# Altium schematic sheet uC_HMI.SchDoc
size A3; Author: TNI; Organization: ETML-ES; Address1: Avenue Recordon 1; Address2: 1004 Lausanne; Address3: Switzerland; Revision: 1; SheetNumber: 1; SheetTotal: 3; SPICEModelCacheNXRZMLBE: <root> / <DocumentId>NXRZMLBE</DocumentId> / <CacheFrame Number="0"> / <Model Name="nmos" Kind="MDL"> / <Text>*Default N-Channel MOSFET / *Pinout: D,G,S / .MODEL NMOS NMOS()</Text> / </Model> / <Model Name="pnp" Kind="MDL"> / <Text>*Default PNP BJT / *PNP Trans Pinout: C,B,E / .MODEL PNP PNP()</Text> / </Model> / <Model Name="diode" Kind="MDL"> / <Text>*Default Diode / *Diode Pinout: A,K / .MODEL DIODE D()</Text> / </Model> / </CacheFrame> / </root>; Version: 2226_A
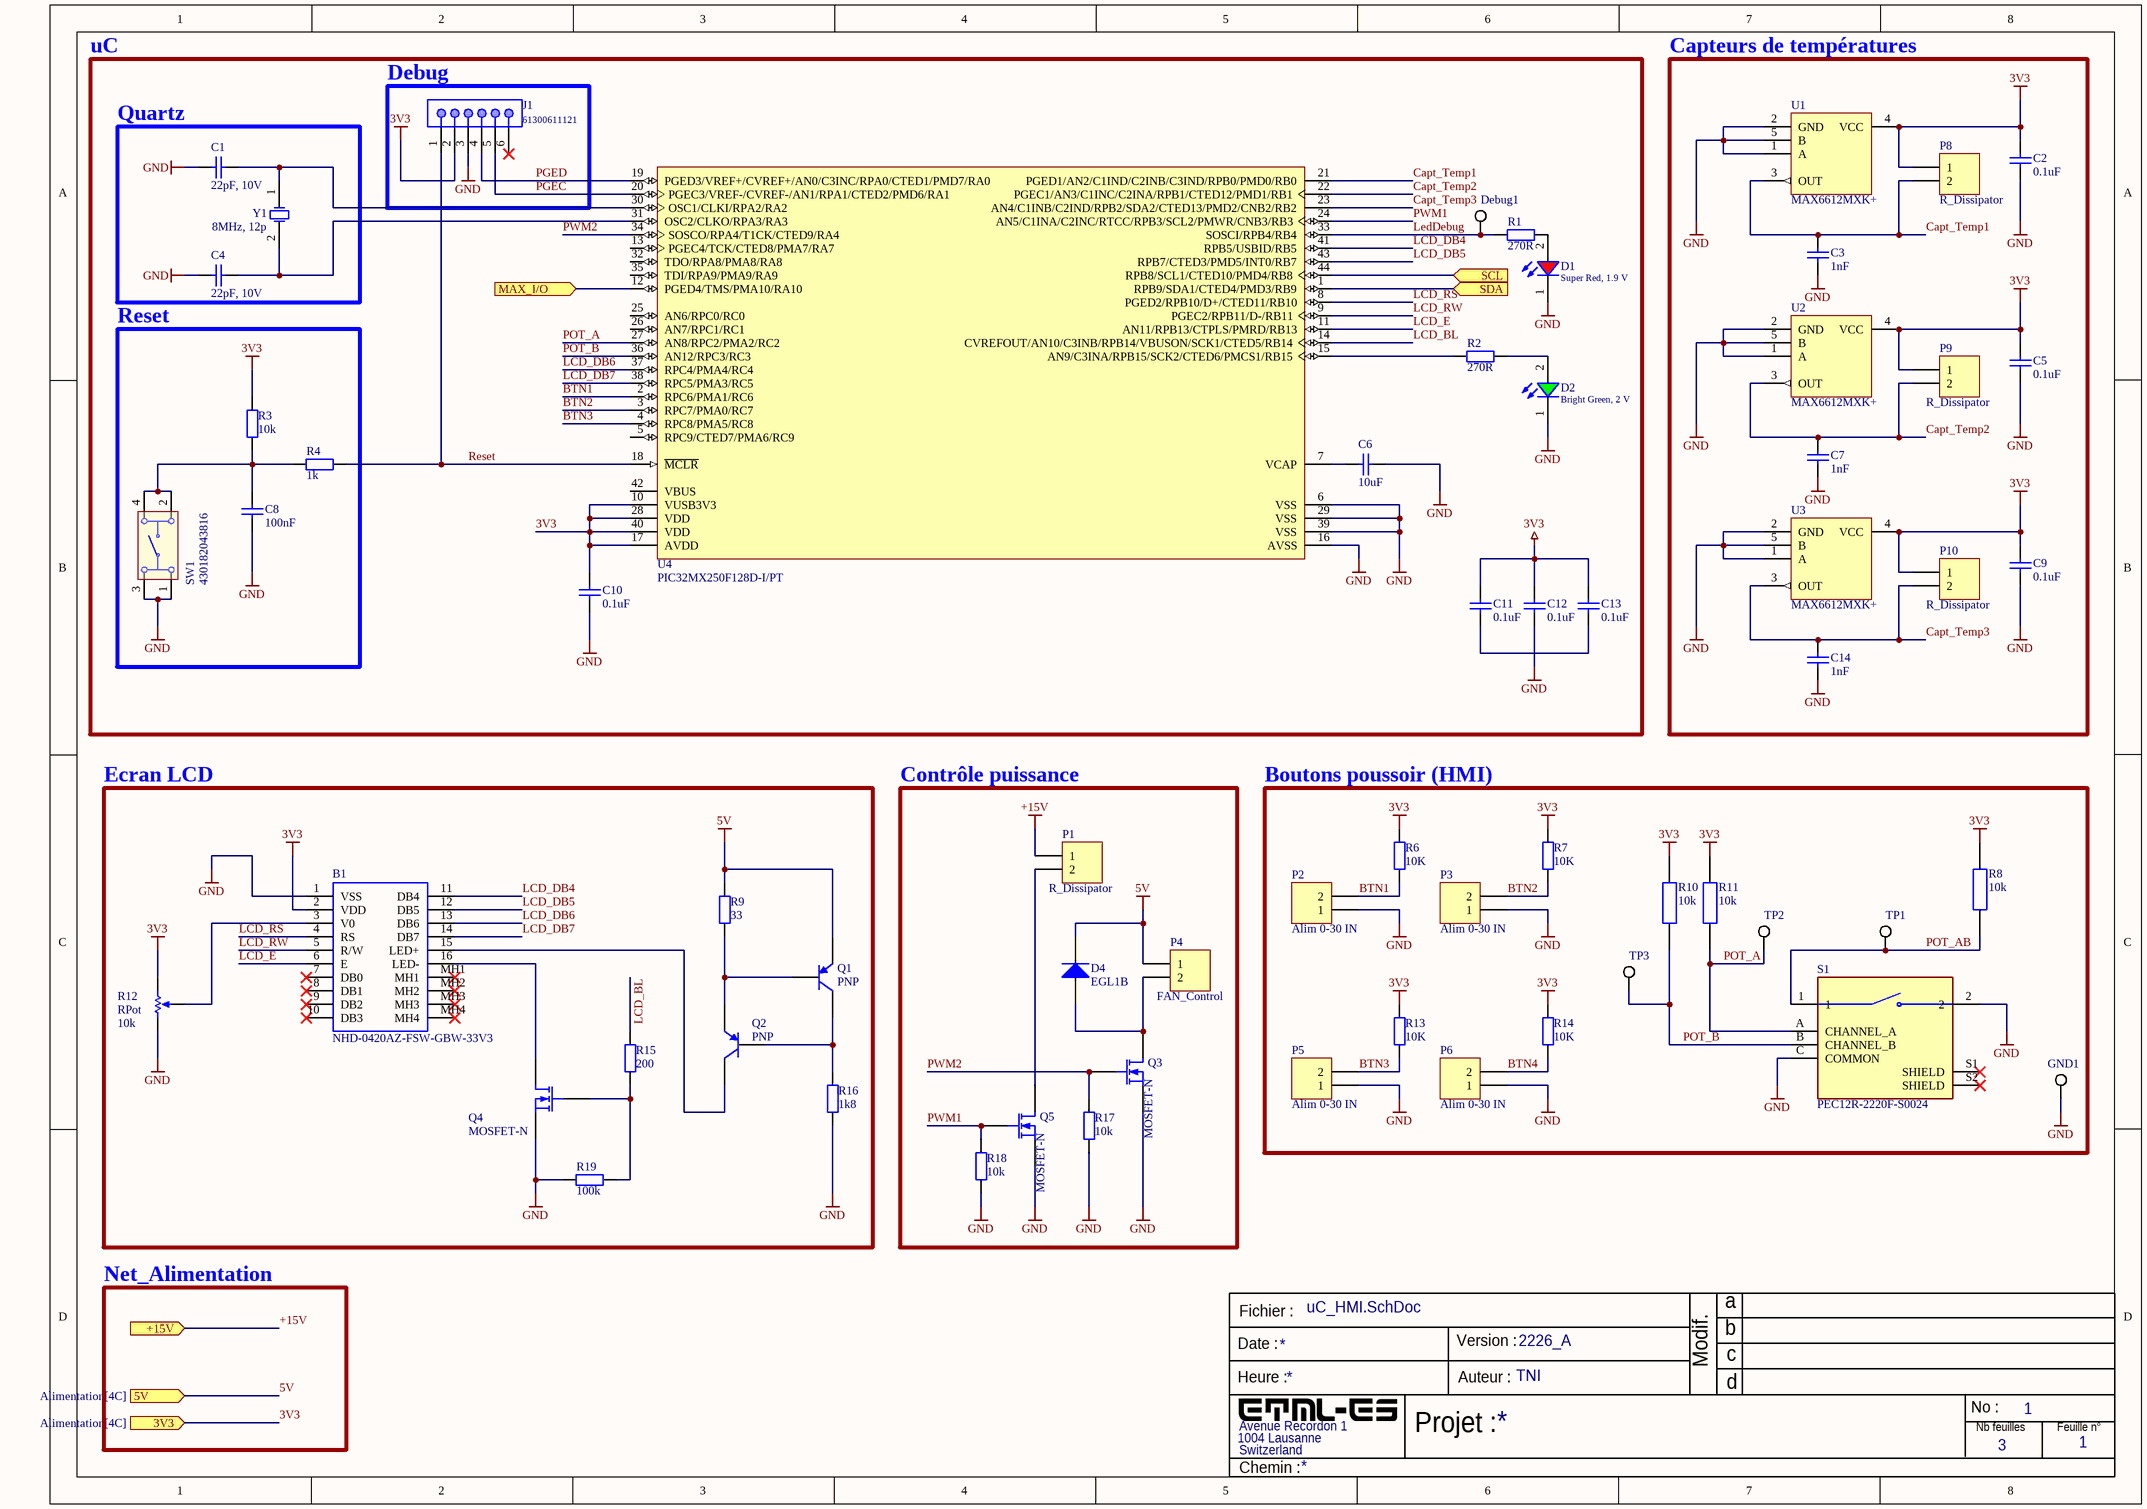
[diagram p0: uC_HMI.SchDoc]

## Parts
B1  NHD-0420AZ-FSW-GBW-33V3  [NHD0420AZFSWGBW33V3]
C1  22pF, 10V  [6-0805_L]
C2  value 0.1uF  [C0805]  (hidden comment: Cap)
C3  value 1nF  [C0805]  (hidden comment: Cap)
C4  22pF, 10V  [6-0805_L]
C5  value 0.1uF  [C0805]  (hidden comment: Cap)
C6  value 10uF  [C0805]  (hidden comment: Cap)
C7  value 1nF  [C0805]  (hidden comment: Cap)
C8  value 100nF  [C0805]  (hidden comment: Cap)
C9  value 0.1uF  [C0805]  (hidden comment: Cap)
C10  value 0.1uF  [C0805]  (hidden comment: Cap)
C11  value 0.1uF  [C0805]  (hidden comment: Cap)
C12  value 0.1uF  [C0805]  (hidden comment: Cap)
C13  value 0.1uF  [C0805]  (hidden comment: Cap)
C14  value 1nF  [C0805]  (hidden comment: Cap)
D1  Super Red, 1.9 V  [6-0805_N]
D2  Bright Green, 2 V  [6-0805_N]
D4  EGL1B  [JAN1N4108CUR1_]
Debug1  LedDebugg  [KSTN-5019_V]  (value not drawn)
GND1  PEC12  [KSTN-5019_V]  (value not drawn)
J1  61300611121  [HDR1X6]
P1  R_Dissipator  [RHDRRA2W95P0X500_1X2_1120X900X1280P]
P2  Alim 0-30 IN  [HDR1X2]
P3  Alim 0-30 IN  [HDR1X2]
P4  FAN_Control  [RHDRRA2W95P0X500_1X2_1120X900X1280P]
P5  Alim 0-30 IN  [HDR1X2]
P6  Alim 0-30 IN  [HDR1X2]
P8  R_Dissipator  [RHDRRA2W95P0X500_1X2_1120X900X1280P]
P9  R_Dissipator  [RHDRRA2W95P0X500_1X2_1120X900X1280P]
P10  R_Dissipator  [RHDRRA2W95P0X500_1X2_1120X900X1280P]
Q1  PNP  [SOT-23B_N]
Q2  PNP  [SOT-23B_N]
Q3  MOSFET-N  [SOT23_N]
Q4  MOSFET-N  [SOT23_N]
Q5  MOSFET-N  [SOT23_N]
R1  270R  [6-0805_N]
R2  270R  [6-0805_N]
R3  10k  [6-0805_N]
R4  1k  [6-0805_N]
R6  value 10K  [6-0805_N]  (hidden comment: Res 10K)
R7  value 10K  [6-0805_N]  (hidden comment: Res 10K)
R8  10k  [6-0805_N]
R9  value 33  [6-0805_N]  (hidden comment: Res2)
R10  10k  [6-0805_N]
R11  10k  [6-0805_N]
R12  RPot  value 10k  [3362P_1]
R13  value 10K  [6-0805_N]  (hidden comment: Res 10K)
R14  value 10K  [6-0805_N]  (hidden comment: Res 10K)
R15  value 200  [6-0805_N]  (hidden comment: Res2)
R16  value 1k8  [6-0805_N]  (hidden comment: Res2)
R17  value 10k  [6-0805_N]  (hidden comment: Res2)
R18  value 10k  [6-0805_N]  (hidden comment: Res2)
R19  value 100k  [6-0805_N]  (hidden comment: Res2)
S1  PEC12R-2220F-S0024  [XDCR_PEC12R-2220F-S0024]
SW1  430182043816  [430182043816]
TP1  REGP  [KSTN-5019_V]  (value not drawn)
TP2  REGP  [KSTN-5019_V]  (value not drawn)
TP3  REGP  [KSTN-5019_V]  (value not drawn)
U1  MAX6612MXK+  [MAXM-X5+1_M]
U2  MAX6612MXK+  [MAXM-X5+1_M]
U3  MAX6612MXK+  [MAXM-X5+1_M]
U4  PIC32MX250F128D-I/PT  [MCHP-TQFP-PT44_M]
Y1  8MHz, 12p  [FOX-FOXSDLF160-20_V]

## Blocks framed on the sheet
uC: C6 C10-C13 D1 D2 Debug1 R1 R2 U4
Capteurs de températures: C2 C3 C5 C7 C9 C14 P8-P10 U1-U3
Quartz: C1 C4 Y1
Debug: J1
Reset: C8 R3 R4 SW1
Ecran LCD: B1 Q1 Q2 Q4 R9 R12 R15 R16 R19
Contrôle puissance: D4 P1 P4 Q3 Q5 R17 R18
Boutons poussoir (HMI): GND1 P2 P3 P5 P6 R6-R8 R10 R11 R13 R14 S1 TP1-TP3

## Ports
3V3 (in, see Alimentation[4C]), 5V (in, see Alimentation[4C]), +15V (in, see Alimentation[3C], Regulation_PID[1D]), MAX_I/O (in, see Alimentation[1B]), SCL (in, see Alimentation[1B]), SDA (in, see Alimentation[1B])

## Nets
3V3: B1.2(VDD) C2.1 C5.1 C9.1 C10.2 C11.1 C12.1 C13.1 J1.2 P8.1 P9.1 P10.1 R3.2 R6.2 R7.2 R8.2 R10.2 R11.2 R12.2(BOT) R13.2 R14.2 U1.4(VCC) U2.4(VCC) U3.4(VCC) U4.10(VUSB3V3) U4.17(AVDD) U4.28(VDD) U4.40(VDD) ; port 3V3
5V: D4.2(K) P4.1 Q1.3(E) R9.1 ; port 5V
+15V: P1.1 ; port +15V
GND: B1.1(VSS) C1.1 C2.2 C3.2 C4.1 C5.2 C6.1 C7.2 C8.2 C9.2 C10.1 C12.2 C14.2 D1.1(K) D2.1(K) GND1.1 J1.3 P2.1 P3.1 P5.1 P6.1 Q3.3(S) Q4.3(S) Q5.3(S) R12.1(TOP) R16.2 R17.1 R18.1 R19.1 S1.2 S1.C(COMMON) SW1.1 SW1.3 U1.1(A) U1.2(GND) U1.5(B) U2.1(A) U2.2(GND) U2.5(B) U3.1(A) U3.2(GND) U3.5(B) U4.6(VSS) U4.16(AVSS) U4.29(VSS) U4.39(VSS)
BTN1: P2.2 R6.1 U4.2(RPC6/PMA1/RC6)
BTN2: P3.2 R7.1 U4.3(RPC7/PMA0/RC7)
BTN3: P5.2 R13.1 U4.4(RPC8/PMA5/RC8)
BTN4: P6.2 R14.1
Capt_Temp1: C3.1 P8.2 U1.3(OUT) U4.21(PGED1/AN2/C1IND/C2INB/C3IND/RPB0/PMD0/RB0)
Capt_Temp2: C7.1 P9.2 U2.3(OUT) U4.22(PGEC1/AN3/C1INC/C2INA/RPB1/CTED12/PMD1/RB1)
Capt_Temp3: C14.1 P10.2 U3.3(OUT) U4.23(AN4/C1INB/C2IND/RPB2/SDA2/CTED13/PMD2/CNB2/RB2)
LCD_BL: R15.1 U4.14(CVREFOUT/AN10/C3INB/RPB14/VBUSON/SCK1/CTED5/RB14)
LCD_DB4: B1.11(DB4) U4.41(RPB5/USBID/RB5)
LCD_DB5: B1.12(DB5) U4.43(RPB7/CTED3/PMD5/INT0/RB7)
LCD_DB6: B1.13(DB6) U4.37(RPC4/PMA4/RC4)
LCD_DB7: B1.14(DB7) U4.38(RPC5/PMA3/RC5)
LCD_E: B1.6(E) U4.11(AN11/RPB13/CTPLS/PMRD/RB13)
LCD_RS: B1.4(RS) U4.8(PGED2/RPB10/D+/CTED11/RB10)
LCD_RW: B1.5(R/W) U4.9(PGEC2/RPB11/D-/RB11)
LedDebug: Debug1.1 R1.2 U4.33(SOSCI/RPB4/RB4)
MAX_I/O: U4.12(PGED4/TMS/PMA10/RA10) ; port MAX_I/O
PGEC: J1.5 U4.20(PGEC3/VREF-/CVREF-/AN1/RPA1/CTED2/PMD6/RA1)
PGED: J1.4 U4.19(PGED3/VREF+/CVREF+/AN0/C3INC/RPA0/CTED1/PMD7/RA0)
POT_A: R11.1 S1.A(CHANNEL_A) TP2.1 U4.27(AN8/RPC2/PMA2/RC2)
POT_AB: R8.1 S1.1 TP1.1
POT_B: R10.1 S1.B(CHANNEL_B) TP3.1 U4.36(AN12/RPC3/RC3)
PWM1: Q5.2(G) R18.2 U4.24(AN5/C1INA/C2INC/RTCC/RPB3/SCL2/PMWR/CNB3/RB3)
PWM2: Q3.2(G) R17.2 U4.34(SOSCO/RPA4/T1CK/CTED9/RA4)
Reset: J1.1 R4.2 U4.18(~{MCLR})
SCL: U4.44(RPB8/SCL1/CTED10/PMD4/RB8) ; port SCL
SDA: U4.1(RPB9/SDA1/CTED4/PMD3/RB9) ; port SDA
NetB1_3: B1.3(V0) R12.3(TAP)
NetB1_15: B1.15(LED+) Q2.1(C)
NetB1_16: B1.16(LED-) Q4.1(D)
NetC1_2: C1.2 U4.30(OSC1/CLKI/RPA2/RA2) Y1.1(X1)
NetC4_2: C4.2 U4.31(OSC2/CLKO/RPA3/RA3) Y1.2(X2)
NetC6_2: C6.2 U4.7(VCAP)
NetC8_1: C8.1 R3.1 R4.1 SW1.2 SW1.4
NetC11_2: C11.2 C13.2
NetD1_2: D1.2(A) R1.1
NetD2_2: D2.2(A) R2.1
NetD4_1: D4.1(A) P4.2 Q3.1(D)
NetP1_2: P1.2 Q5.1(D)
NetQ1_1: Q1.1(C) Q2.2(B) R16.1
NetQ1_2: Q1.2(B) Q2.3(E) R9.2
NetQ4_2: Q4.2(G) R15.2 R19.2
NetR2_2: R2.2 U4.15(AN9/C3INA/RPB15/SCK2/CTED6/PMCS1/RB15)

Not connected (* = marked no-connect by the designer): B1 7(DB0)* 8(DB1)* 9(DB2)* 10(DB3)* MH1* MH2* MH3* MH4*; J1 6*; S1 S1(SHIELD)* S2(SHIELD)*; U4 5(RPC9/CTED7/PMA6/RC9) 13(PGEC4/TCK/CTED8/PMA7/RA7) 25(AN6/RPC0/RC0) 26(AN7/RPC1/RC1) 32(TDO/RPA8/PMA8/RA8) 35(TDI/RPA9/PMA9/RA9) 42(VBUS)

## Notes on the sheet
- Net_Alimentation
- Fichier :
- a
- Date :
- Heure :
- Version :
- Auteur :
- Modif.
- b
- c
- d
- Projet :
- No :
- Nb feuilles
- Feuille n°
- Chemin :

## Library data of the parts
B1 = NHD-0420AZ-FSW-GBW-33V3: LCD Character Display Modules & Accessories STN- GRAY Transfl 77.5 x 47.0; Manufacturer_Name: Newhaven Display; Geometry.Height: 14.5mm; Manufacturer_Part_Number: NHD-0420AZ-FSW-GBW-33V3; Mouser Part Number: 763-0420AZFSWGBW33V3; Mouser Price/Stock: https://www.mouser.co.uk/ProductDetail/Newhaven-Display/NHD-0420AZ-FSW-GBW-33V3?qs=G49gCGQm93jUf0i9XnwMsw%3D%3D; Arrow Part Number: *; Arrow Price/Stock: *; Mouser Testing Part Number: *; Mouser Testing Price/Stock: *; Datasheet Link: http://www.newhavendisplay.com/specs/NHD-0420AZ-FSW-GBW-33V3.pdf
C1 C4 = CMP-1036-01211-1: CAP 22pF 10V; Case-Metric: 2012; Tolerance: Â±10%; Case-EIA: 0805; Rated Voltage: 10 V; Technology: SMT; Max Thickness: 0.75 mm; Value: 22pF
C2 C5 C6 C8-C13 = Cap: Cap 100nF; Published: 8-Jun-2000; LatestRevisionDate: 17-Jul-2002; LatestRevisionNote: Re-released for DXP Platform.; PackageReference: RAD-0.3; Publisher: Altium Limited; PackageDescription: Radial Cap, Thru-Hole; 2 Leads; 0.3 in Pin Spacing
C3 C7 C14 = Cap: Cap 1nF; Published: 8-Jun-2000; LatestRevisionDate: 17-Jul-2002; LatestRevisionNote: Re-released for DXP Platform.; PackageReference: RAD-0.3; Publisher: Altium Limited; PackageDescription: Radial Cap, Thru-Hole; 2 Leads; 0.3 in Pin Spacing
D1 = 150080SS75000: SMT Mono-color Chip LED Waterclear WL-SMCW, size 0805, Super Red, 1.9 V, 140 deg, 60 mcd; Forward Voltage: 1.9 V; Viewing Angle: 140 deg; Peak Wavelength: 645 nm; Dominant Wavelength: 630 nm; Luminous Intensity: 60 mcd; Chip Technology: AlInGaP; ComponentLink1Description: Manufacturer; ComponentLink1URL: http://www.we-online.de; ComponentLink2Description: Datasheet; ComponentLink2URL: https://katalog.we-online.de/led/datasheet/150080SS75000.pdf; Part Number: 150080SS75000; Published Date: November 2018; Publisher: Wurth Elektronik; Size: 0805; Operating Temperature: -40 to 85 degC; Emitting Color: Super Red; Mounting Technology: SMT; Packaging: Tape and Reel; Supplier 1: Digi-Key; Supplier Part Number 1: 732-4985-1-ND; Supplier 2: Distrelec; Supplier Part Number 2: 30008875
D2 = 150080VS75000: SMT Mono-color Chip LED Waterclear WL-SMCW, size 0805, Bright Green, 2 V, 140 deg, 40 mcd; Forward Voltage: 2 V; Viewing Angle: 140 deg; Peak Wavelength: 572 nm; Dominant Wavelength: 570 nm; Luminous Intensity: 40 mcd; Chip Technology: AlInGaP; ComponentLink1Description: Manufacturer; ComponentLink1URL: http://www.we-online.de; ComponentLink2Description: Datasheet; ComponentLink2URL: https://katalog.we-online.de/led/datasheet/150080VS75000.pdf; Part Number: 150080VS75000; Published Date: November 2018; Publisher: Wurth Elektronik; Size: 0805; Operating Temperature: -40 to 85 degC; Emitting Color: Bright Green; Mounting Technology: SMT; Packaging: Tape and Reel; Supplier 1: Digi-Key; Supplier Part Number 1: 732-4986-1-ND; Supplier 2: Distrelec; Supplier Part Number 2: 30008876
D4 = Diode: Diode Melf : EGL1B (100V,1A); Published: 8-Jun-2000; LatestRevisionDate: 17-Jul-2002; LatestRevisionNote: Re-released for DXP Platform.; PackageVersion: Sep-1996; PackageReference: SMC; Publisher: Altium Limited; PackageDescription: DO-214-AB/SMC; 2 C-Bend Leads; Body 7.9 x 5.9 mm, inc. leads (LxW); Code_JEDEC: DO-214-AB
Debug1 GND1 TP1-TP3 = CMP-1672-00008-1: Test Point, 1 Position SMD, RoHS, Tape and Reel; ComponentLink1Description: Manufacturer URL; Package Quantity: 1000; DatasheetVersion: 03/2014; Packaging: Tape and Reel; ComponentLink2URL: http://www.keyelco.com/product-pdf.cfm?p=1357; ComponentLink1URL: http://www.keyelco.com/; Mount: Surface Mount; Contact Plating: Silver; PackageDescription: 1-Pin Surface Mount Device, Body 3.81 x 2.03 mm; Pins: 1; RoHSCompliant: True; Mounting Technology: Surface Mount; ComponentLink2Description: Datasheet; PackageReference: 5019
J1 = 61300611121: WR-PHD Pin Header, THT, pitch 2.54mm, Single Row, Vertical, 6pin; Pin Number: 6; Gender: Male; Rated Current: 3A; Working Voltage: 250VAC; Withstanding Voltage: 500VAC; Contact Resistance: 20mOhm; ComponentLink1Description: Manufacturer; ComponentLink1URL: http://www.we-online.de; ComponentLink2Description: Datasheet; ComponentLink2URL: https://katalog.we-online.de/em/datasheet/6130xx11121.pdf; Part Number: 61300611121; Published Date: June 2019; Publisher: Wurth Elektronik; Pitch: 2.54mm; Operating Temperature: -40 to +105degC; Mounting Technology: THT; Packaging: Bag; Row Number: Single; Orientation: Vertical; Supplier 1: Digi-Key; Supplier Part Number 1: 732-5319-ND; Supplier 2: Distrelec; Supplier Part Number 2: 30024526
P1-P6 P8-P10 = Header 2: Header, 2-Pin; LatestRevisionDate: 17-Jul-2002; LatestRevisionNote: Re-released for DXP Platform.; Publisher: Altium Limited
Q1 Q2 = PNP: PNP Bipolar Transistor; Published: 8-Jun-2000; LatestRevisionDate: 29-May-2009; LatestRevisionNote: IPC-7351 Footprint Added.; PackageVersion: Aug-1999; PackageReference: SOT-23B; Publisher: Altium Limited; PackageDescription: 3-Pin SOT-23 Package 0.95 mm Pitch, 2.4 mm Lead Span
Q3-Q5 = MOSFET-N: N-Channel MOSFET; Published: 8-Jun-2000; LatestRevisionDate: 17-Jul-2002; LatestRevisionNote: Re-released for DXP Platform.; PackageVersion: 1995/1996; PackageReference: E3; Publisher: Altium Limited; PackageDescription: TO, Flat Index; 3 In-Line, Axial Leads; Body Dia. 4.6mm; Lead Dia. 0.5 mm (max)
R1 R2 = CMP-2001-00528-1: Res 270R; Part Number: ERJ6ENF2703V; Manufacturer: Panasonic
R3 = CMP-2001-04376-1: Res 10K; Manufacturer: Panasonic; Part Number: ERJ-6ENF1002V
R4 = CMP-1013-00510-2: Res 1K; Part Number: CRCW08051K00FKEA; Manufacturer: Vishay Dale
R6 R7 R13 R14 = Res2: Published: 8-Jun-2000; LatestRevisionDate: 17-Jul-2002; LatestRevisionNote: Re-released for DXP Platform.; PackageReference: AXIAL-0.4; Publisher: Altium Limited; PackageDescription: Axial Device, Thru-Hole; 2 Leads; 0.4 in Pin Spacing
R8 R10 R11 = Resistor: Res 10K; Supplier: Stock ES; Value: 10k
R9 = Res2: Res 33R; Published: 8-Jun-2000; LatestRevisionDate: 17-Jul-2002; LatestRevisionNote: Re-released for DXP Platform.; PackageReference: AXIAL-0.4; Publisher: Altium Limited; PackageDescription: Axial Device, Thru-Hole; 2 Leads; 0.4 in Pin Spacing
R12 = RPot: Pot 10K; Sim Note: Enter the Resistance value and the set point into parameter fields.; Set Position: 0.5; Published: 8-Jun-2000; LatestRevisionDate: 17-Jul-2002; LatestRevisionNote: Re-released for DXP Platform.; PackageReference: VR5; Publisher: Altium Limited; PackageDescription: Variable Resistor, Thru-Hole; 3 Leads
R15 = Res2: Res 200R; Published: 8-Jun-2000; LatestRevisionDate: 17-Jul-2002; LatestRevisionNote: Re-released for DXP Platform.; PackageReference: AXIAL-0.4; Publisher: Altium Limited; PackageDescription: Axial Device, Thru-Hole; 2 Leads; 0.4 in Pin Spacing
R16 = Res2: Res 1K8; Published: 8-Jun-2000; LatestRevisionDate: 17-Jul-2002; LatestRevisionNote: Re-released for DXP Platform.; PackageReference: AXIAL-0.4; Publisher: Altium Limited; PackageDescription: Axial Device, Thru-Hole; 2 Leads; 0.4 in Pin Spacing
R17 R18 = Res2: Res 10K; Published: 8-Jun-2000; LatestRevisionDate: 17-Jul-2002; LatestRevisionNote: Re-released for DXP Platform.; PackageReference: AXIAL-0.4; Publisher: Altium Limited; PackageDescription: Axial Device, Thru-Hole; 2 Leads; 0.4 in Pin Spacing
R19 = Res2: Res 100K; Published: 8-Jun-2000; LatestRevisionDate: 17-Jul-2002; LatestRevisionNote: Re-released for DXP Platform.; PackageReference: AXIAL-0.4; Publisher: Altium Limited; PackageDescription: Axial Device, Thru-Hole; 2 Leads; 0.4 in Pin Spacing
S1 = PEC12R-2220F-S0024: Rotary Encoder Mechanical 24 Quadrature (Incremental) Right Angle; MF: Bourns; SnapEDA_Link: https://www.snapeda.com/parts/PEC12R-2220F-S0024/Bourns/view-part/?ref=snap; MP: PEC12R-2220F-S0024; Check_prices: https://www.snapeda.com/parts/PEC12R-2220F-S0024/Bourns/view-part/?ref=eda; Value: *; Purchase-URL: https://pricing.snapeda.com/search/part/PEC12R-2220F-S0024/?ref=eda; Package: None
SW1 = CMP-1452-00013-1: WS-TASV SMD Tact Switch 6X6 mm; Manufacturer: Wuerth Elektronik; NoPins: 04; ComponentLink2Description: Datasheet; PackageReference: 430182043816; ComponentLink2URL: http://katalog.we-online.de/em/datasheet/4301x2.pdf; ComponentLink1URL: http://www.we-online.com; PartNumber: 430182043816; ComponentLink1Description: Manufacturer URL
U1-U3 = CMP-0253-01154-1: High-Slope, Low-Power, Analog Temperature Sensor, -55 to 150 degC, 5-Pin SOT23 (X5+1), Pb-Free; Parasite Pwr.: No; Mounting Technology: Surface Mount; ComponentLink1Description: Manufacturer URL; ComponentLink2URL: http://datasheets.maximintegrated.com/en/ds/MAX6612-MAX6612MXK.pdf; PackageDescription: 5-Pin SC70 Transistor Package (X5+1), Body 2 x 1.25 mm, Pitch 0.65 mm; Generic Part Number: MAX6612; PackageVersion: Rev. F, 06/2011; ComponentLink1URL: http://www.maximintegrated.com/; DatasheetVersion: Rev. 0; PartNumber: MAX6612MXK+; ComponentLink2Description: Datasheet; PackageReference: X5+1; Code_JEDEC: MO-203; ComponentLink3URL: http://pdfserv.maximintegrated.com/package_dwgs/21-0076.PDF; Interface: Analog; ComponentLink3Description: Package Specification
U4 = CMP-0048-00499-1: 32-bit Microcontroller with Audio and Graphics Interface, USB and Advanced Analog, 50 MHz, 33 I/O, PMP, -40 to 85 degC, 44-pin TQFP (PT44), Tray; Manufacturer: Microchip; PackageDescription: 44-Lead Plastic Thin Quad Flatpack, 10 x 10 mm Body, 0.8 mm Pitch; ComponentLink1Description: Manufacturer URL; ComponentLink4Description: Product URL; ComponentLink2Description: Datasheet; ComponentLink3Description: Package Specification; PartNumber: PIC32MX250F128D-I/PT; ComponentLink2URL: http://ww1.microchip.com/downloads/en/DeviceDoc/61168E.pdf; Mounting Technology: Surface Mount; PackageVersion: C04-076B; ComponentLink4URL: http://www.microchip.com/PIC32MX250F128D; PackageReference: TQFP-PT44; ComponentLink3URL: http://www.microchip.com/stellent/groups/techpub_sg/documents/packagingspec/en012702.pdf; ComponentLink1URL: http://www.microchip.com; DatasheetVersion: Rev. E
Y1 = CMP-1749-00001-1: Resistance Weld SMD Crystal, 8 MHz, +/- 30 ppm, 12 pF, -20 to 70 degC, 2-Pin SMD, RoHS, Tape and Reel; Output Current: 3 mA; Case\Package: SOT-553-6; Min Supply Voltage (DC): 4 V; Max Supply Voltage: 3.3 V; Min Supply Voltage: 1.4 V; Interface: I2C; Max Supply Voltage (DC): 6 V; Value: 8M, 12p; ComponentLink2Description: Datasheet; REACH SVHC: No SVHC; ComponentLink1URL: http://www.foxonline.com/; ComponentLink2URL: http://foxonline.com/pdfs/hc49sdlf.pdf; Pins: 6; Packaging: Cut Tape; ComponentLink1Description: Manufacturer URL; Weight: 9.9E-05 oz; Length: 1.6 mm; RoHSCompliant: true; Min Operating Temperature: -55 degC; Radiation Hardening: No; PackageDescription: 2-Pin Surface Mount Device, Body 5 x 11.7 mm, Height 4.5 mm; Package Quantity: 1; Width: 1.2 mm; DatasheetVersion: Mar-15; Max Operating Temperature: 150 degC; Mount: Surface Mount; PackageReference: FOX-FOXSDLF160-20; Height: 0.55 mm